# EAGLE design LaunchPadMikroBUS_SIL (EAGLE 6.4)
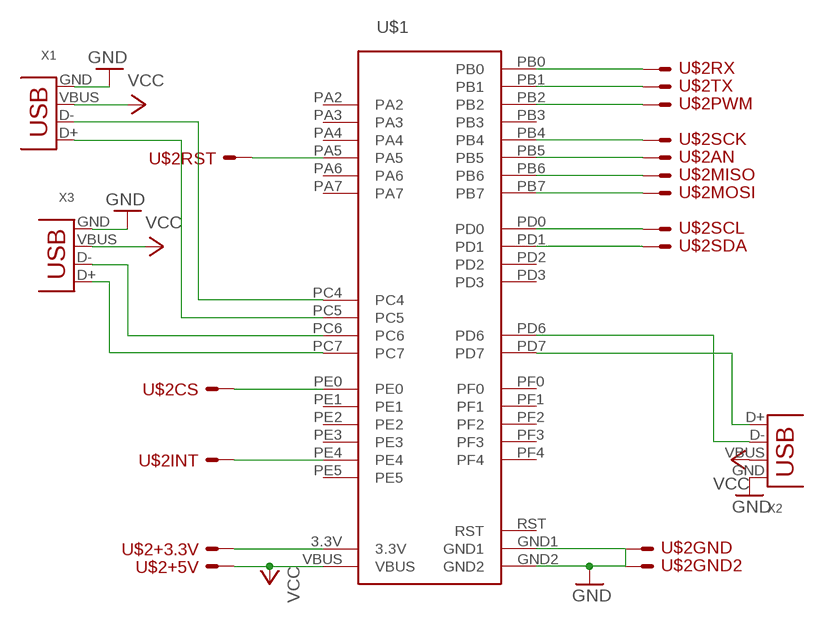
[diagram p0: schematic, sheet 1]

## Parts
U$1  STELLARIS-LAUNCHPADSTELLARIS-LAUNCHPAD-XL  [LAUNCHPAD-XL]
U$2  MIKROBUSSIL  [MIKROBUS_SIL]
X1  USB-A-H  [USB-A-H]
X2  USB-A-H  [USB-A-H]
X3  USB-A-H  [USB-A-H]

## Nets
GND: U$1.GND1 U$1.GND2 U$2.GND U$2.GND2 X1.GND X2.GND X3.GND
N$1: U$1.PB2 U$2.PWM
N$2: U$1.PE4 U$2.INT
N$3: U$1.PB0 U$2.RX
N$4: U$1.PB1 U$2.TX
N$5: U$1.PD0 U$2.SCL
N$6: U$1.PD1 U$2.SDA
N$7: U$1.PC7 X3.D+
N$8: U$1.PC6 X3.D-
N$9: U$1.PC5 X1.D+
N$10: U$1.3.3V U$2.+3.3V
N$11: U$1.PB5 U$2.AN
N$12: U$1.PA5 U$2.RST
N$13: U$1.PE0 U$2.CS
N$14: U$1.PB4 U$2.SCK
N$15: U$1.PB7 U$2.MOSI
N$16: U$1.PB6 U$2.MISO
N$17: U$1.PC4 X1.D-
N$18: U$1.PD7 X2.D+
N$19: U$1.PD6 X2.D-
VCC: U$1.VBUS U$2.+5V X1.VBUS X2.VBUS X3.VBUS
Unconnected: U$1.PA2 U$1.PA3 U$1.PA4 U$1.PA6 U$1.PA7 U$1.PB3 U$1.PD2 U$1.PD3 U$1.PE1 U$1.PE2 U$1.PE3 U$1.PE5 U$1.PF0 U$1.PF1 U$1.PF2 U$1.PF3 U$1.PF4

## Power pins joined to a net without a drawn wire
RST: U$1.RST

## Library data of the parts
U$1 = StellarisLaunchPad_Fred:STELLARIS-LAUNCHPAD
U$2 = lieven:MIKROBUS
X1-X3 = lieven:USB: USB Connectors

## Board
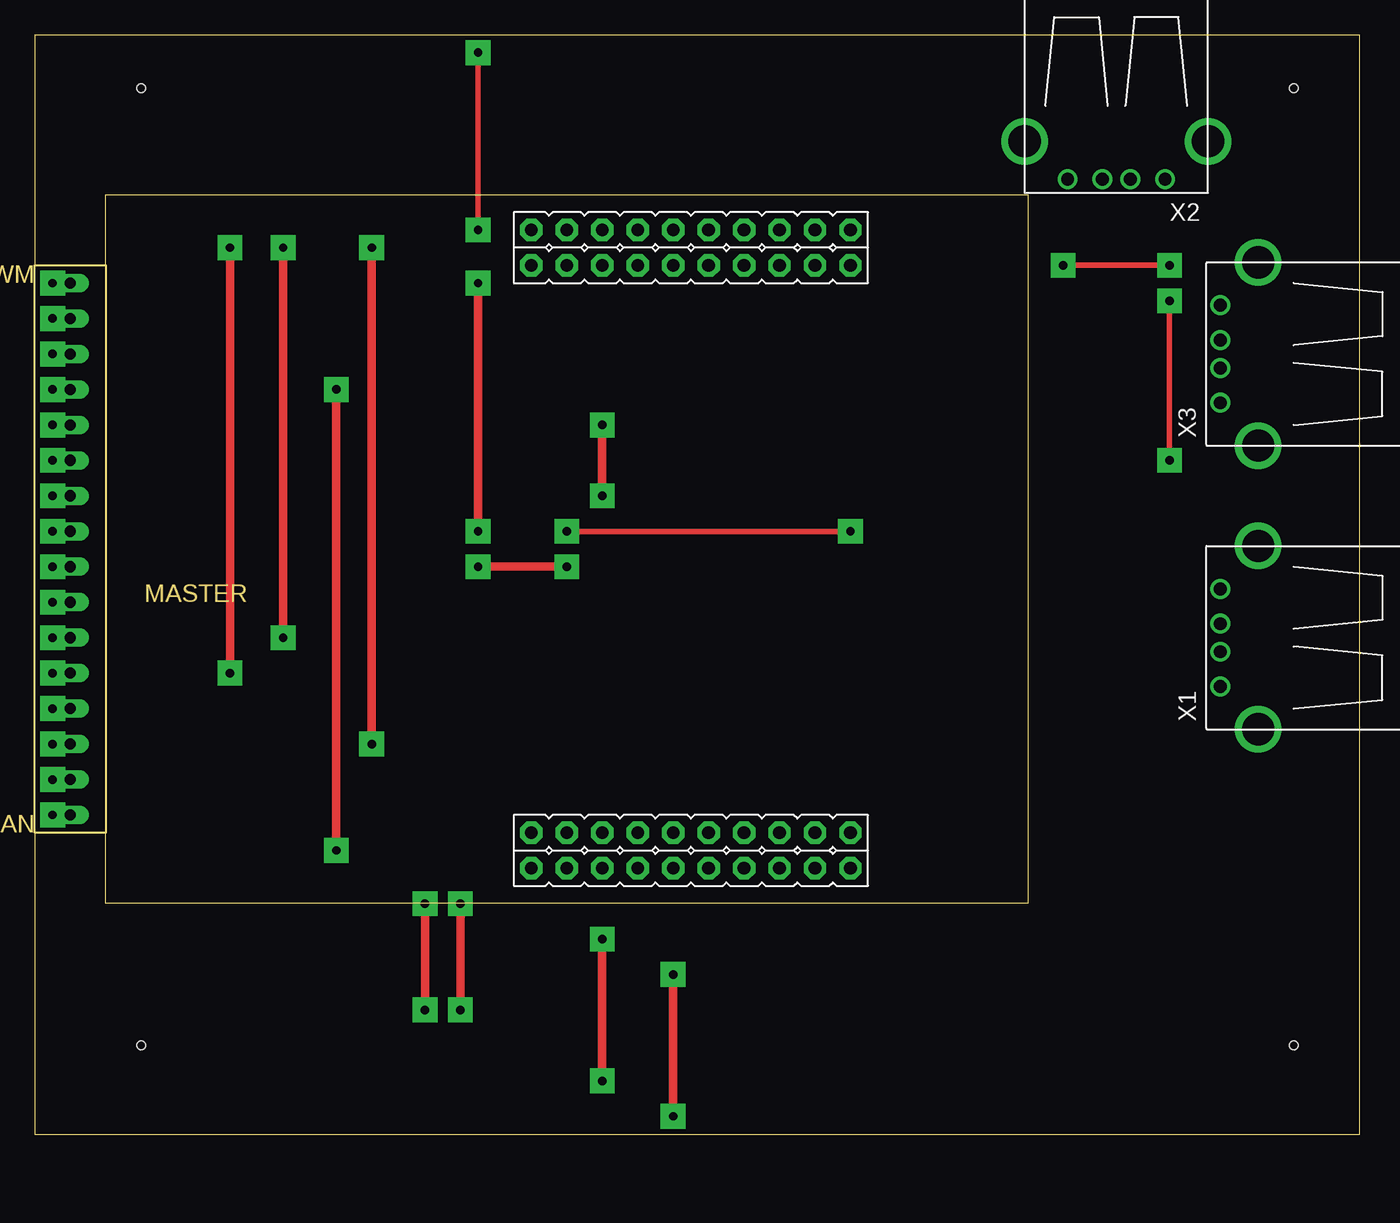
[diagram p1: board, top side]
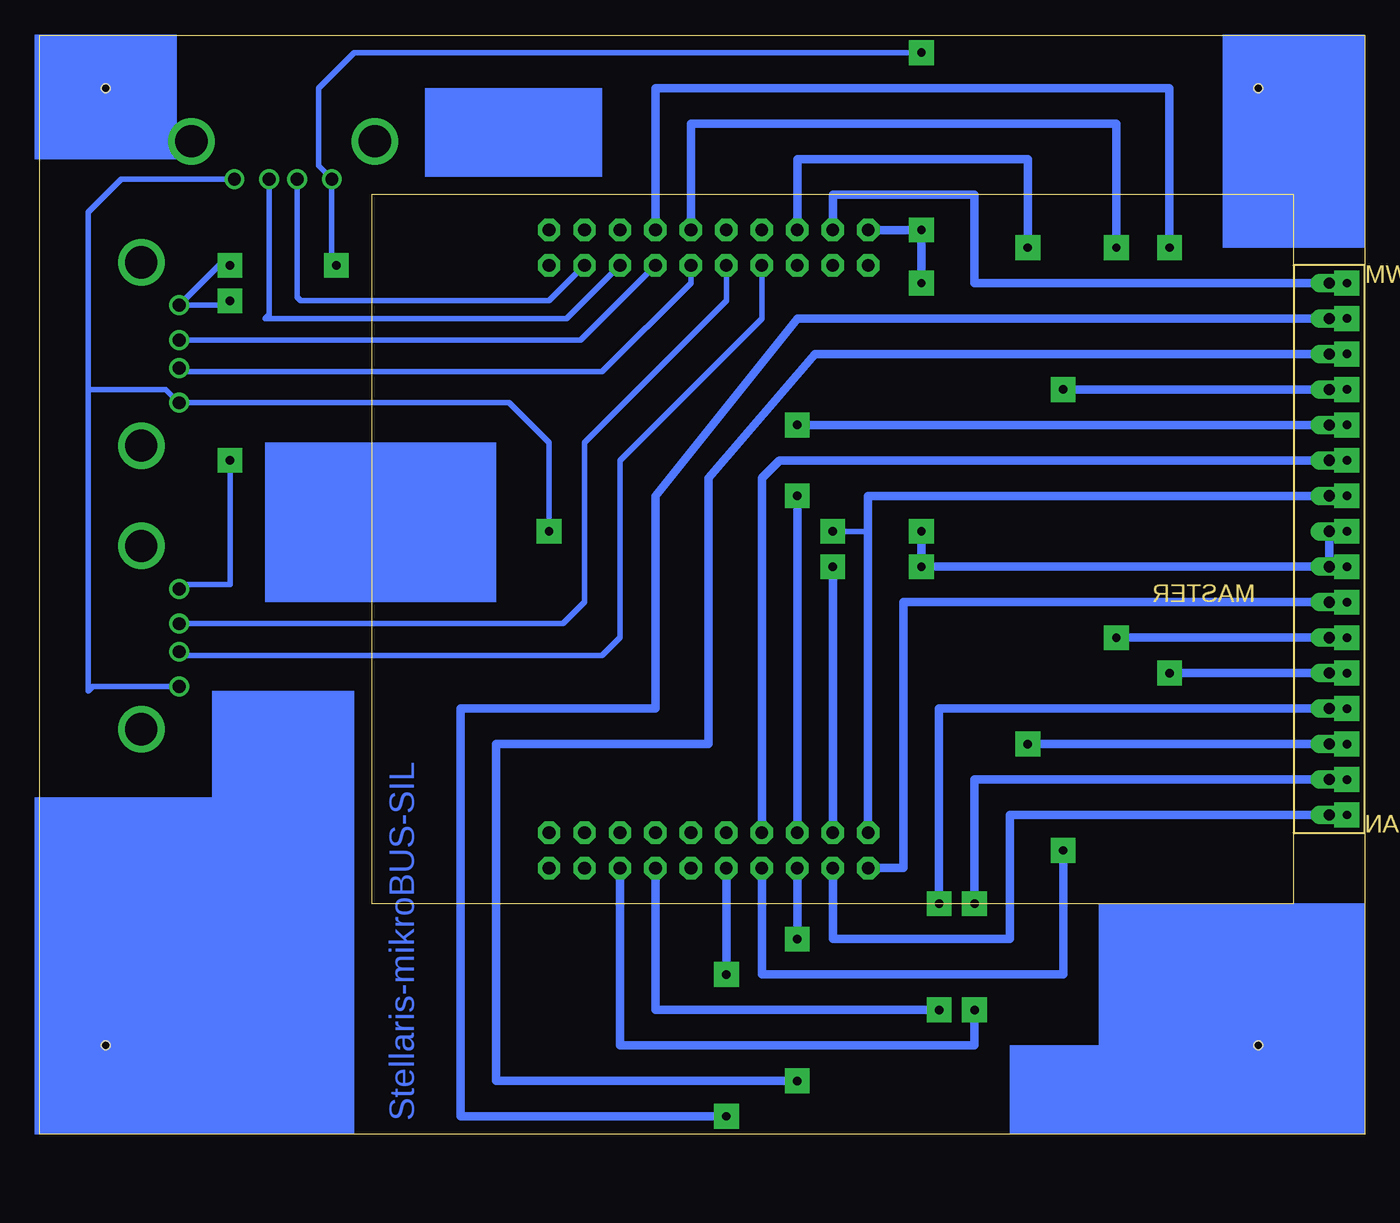
[diagram p2: board, bottom side, seen from below]

Size 94.92 x 78.73 mm. Coordinates in mm from the lower left corner, seen from the top.
Outline: 0,0 94.92,0 94.92,78.73 0,78.73 0,0
Copper layers (1*16): Top 0.035mm / dielectric 1.5mm / Bottom 0.035mm
Design rules "default": minimum track width 10mil, minimum drill 24mil, track to track 8mil, track to pad 8mil, pad to pad 8mil, via to via 8mil, smd to smd 8mil, copper to edge 40mil, drill to drill 8mil, minimum pad ring 10mil, minimum via ring 8mil, stop-mask expansion 4mil, vias tented up to drill 0mil, thermal gap 10mil
Holes 0.6 mm at 7.62,74.93 90.17,74.93 90.17,6.35 7.62,6.35

### Footprints (pad centres in the part's own frame; a part is rotated, then mirrored left to right if it is on the bottom)
LAUNCHPAD-XL = drill 0.914 pad 1.6 octagon: 3.3V 30.48,2.54; GND1 33.02,5.08; GND2 30.48,48.26; PA2 53.34,48.26; PA3 50.8,48.26; PA4 48.26,48.26; PA5 48.26,2.54; PA6 50.8,2.54; PA7 53.34,2.54; PB0 35.56,2.54; PB1 38.1,2.54; PB2 33.02,48.26; PB3 35.56,45.72; PB4 45.72,2.54; PB5 33.02,2.54; PB6 45.72,48.26; PB7 43.18,48.26; PC4 38.1,45.72; PC5 40.64,45.72; PC6 43.18,45.72; PC7 45.72,45.72; PD0 35.56,5.08; PD1 38.1,5.08; PD2 40.64,5.08; PD3 43.18,5.08; PD6 48.26,45.72; PD7 50.8,45.72; PE0 35.56,48.26; PE1 45.72,5.08; PE2 48.26,5.08; PE3 50.8,5.08; PE4 40.64,2.54; PE5 43.18,2.54; PF0 38.1,48.26; PF1 53.34,5.08; PF2 30.48,45.72; PF3 33.02,45.72; PF4 53.34,45.72; RST 40.64,48.26; VBUS 30.48,5.08
MIKROBUS_SIL = drill 0.8 long: +3.3V 0,2.54; +5V 0,-5.08; AN 0,17.78; CS 0,12.7; GND 0,0; GND2 0,-2.54; INT 0,-17.78; MISO 0,7.62; MOSI 0,5.08; PWM 0,-20.32; RST 0,15.24; RX 0,-15.24; SCK 0,10.16; SCL 0,-10.16; SDA 0,-7.62; TX 0,-12.7
USB-A-H = drill 0.914: D+ 2.718,-1.003; D- 2.718,1.003; GND 2.718,-3.493; VBUS 2.718,3.493 | drill 2.311: P$5 0,-6.566; P$6 0,6.566

### Placement (x,y rotation side)
U$1  5.08,16.51 0 top
U$2  2.54,40.64 180 top
X1  87.63,35.56 180 top
X2  77.47,71.12 270 top
X3  87.63,55.88 180 top

### Tracks (layer width: path | path; a pad name or v marks a point on that pad's centre or on a via)
GND  (via drill 0.6 pad 1.78)
  Top 0.406: v31.75,64.77 v31.75,77.47 | v73.66,62.23 v81.28,62.23 | v81.28,59.69 v81.28,48.26
  Top 0.61: v31.75,40.64 v38.1,40.64 | v31.75,60.96 v31.75,43.18
  Bottom 0.406: v31.75,77.47 72.39,77.47 74.93,74.93 74.93,69.35 X2.GND 73.98,62.55 v73.66,62.23 | v81.28,62.23 82.06,62.23 X3.GND 81.6,59.37 v81.28,59.69 | v81.28,48.26 81.28,39.37 84.59,39.37 X1.GND
  Bottom 0.61: v38.1,40.64 U$1.GND1 | U$2.GND2 U$2.GND v31.75,40.64 v31.75,43.18 | U$1.GND2 v31.75,64.77 v31.75,60.96
N$1
  Bottom 0.61: U$2.PWM 27.94,60.96 27.94,67.31 38.1,67.31 U$1.PB2
N$2  (via drill 0.6 pad 1.78)
  Top 0.61: v45.72,1.27 v45.72,11.43
  Bottom 0.61: U$2.INT 40.64,58.42 50.8,45.72 50.8,30.48 64.77,30.48 64.77,1.27 v45.72,1.27 | v45.72,11.43 U$1.PE4
N$3  (via drill 0.6 pad 1.78)
  Top 0.61: v40.64,13.97 v40.64,3.81
  Bottom 0.61: U$1.PB0 v40.64,13.97 | v40.64,3.81 62.23,3.81 62.23,27.94 46.99,27.94 46.99,46.99 39.37,55.88 U$2.RX
N$4  (via drill 0.6 pad 1.78)
  Top 0.61: v21.59,20.32 v21.59,53.34
  Bottom 0.61: U$1.PB1 43.18,11.43 21.59,11.43 v21.59,20.32 | v21.59,53.34 U$2.TX
N$5  (via drill 0.6 pad 1.78)
  Top 0.61: v40.64,45.72 v40.64,50.8
  Bottom 0.61: U$1.PD0 v40.64,45.72 | v40.64,50.8 U$2.SCL
N$6
  Bottom 0.61: U$1.PD1 43.18,46.99 41.91,48.26 U$2.SDA
N$7
  Bottom 0.406: X3.D+ 56.15,56.88 U$1.PC7
N$8
  Bottom 0.406: U$1.PC6 48.26,60.96 54.61,54.61 84.65,54.61 X3.D-
N$9
  Bottom 0.406: X1.D+ 57.42,36.56 55.88,38.1 55.88,49.53 45.72,59.69 U$1.PC5
N$10
  Bottom 0.61: U$1.3.3V 33.02,19.05 33.02,38.1 U$2.+3.3V
N$11
  Bottom 0.61: U$1.PB5 38.1,13.97 25.4,13.97 25.4,22.86 U$2.AN
N$12  (via drill 0.6 pad 1.78)
  Top 0.61: v27.94,16.51 v27.94,8.89
  Bottom 0.61: U$2.RST 27.94,25.4 v27.94,16.51 | v27.94,8.89 27.94,6.35 53.34,6.35 U$1.PA5
N$13  (via drill 0.6 pad 1.78)
  Top 0.61: v24.13,27.94 v24.13,63.5
  Bottom 0.61: U$2.CS v24.13,27.94 | v24.13,63.5 24.13,69.85 40.64,69.85 U$1.PE0
N$14  (via drill 0.6 pad 1.78)
  Top 0.61: v30.48,8.89 v30.48,16.51
  Bottom 0.61: U$1.PB4 50.8,8.89 v30.48,8.89 | v30.48,16.51 30.48,30.48 U$2.SCK
N$15  (via drill 0.6 pad 1.78)
  Top 0.61: v17.78,63.5 v17.78,35.56
  Bottom 0.61: U$1.PB7 48.26,72.39 17.78,72.39 v17.78,63.5 | v17.78,35.56 U$2.MOSI
N$16  (via drill 0.6 pad 1.78)
  Top 0.61: v13.97,33.02 v13.97,63.5
  Bottom 0.61: U$2.MISO v13.97,33.02 | v13.97,63.5 13.97,74.93 50.8,74.93 U$1.PB6
N$17
  Bottom 0.406: U$1.PC4 43.18,58.42 53.34,48.26 53.34,35.56 54.61,34.29 84.65,34.29 X1.D-
N$18
  Bottom 0.406: X2.D+ 76.47,59.96 76.2,59.69 58.42,59.69 U$1.PD7
N$19
  Bottom 0.406: X2.D- 78.47,58.69 78.74,58.42 57.15,58.42 U$1.PD6
N$20  (via drill 0.6 pad 1.78)
  other vias: 1.27,22.86
N$21  (via drill 0.6 pad 1.78)
  other vias: 1.27,25.4
N$22  (via drill 0.6 pad 1.78)
  other vias: 1.27,27.94
N$23  (via drill 0.6 pad 1.78)
  other vias: 1.27,30.48
N$24  (via drill 0.6 pad 1.78)
  other vias: 1.27,33.02
N$25  (via drill 0.6 pad 1.78)
  other vias: 1.27,35.56
N$26  (via drill 0.6 pad 1.78)
  other vias: 1.27,38.1
N$27  (via drill 0.6 pad 1.78)
  other vias: 1.27,40.64
N$28  (via drill 0.6 pad 1.78)
  other vias: 1.27,43.18
N$29  (via drill 0.6 pad 1.78)
  other vias: 1.27,45.72
N$30  (via drill 0.6 pad 1.78)
  other vias: 1.27,48.26
N$31  (via drill 0.6 pad 1.78)
  other vias: 1.27,50.8
N$32  (via drill 0.6 pad 1.78)
  other vias: 1.27,53.34
N$33  (via drill 0.6 pad 1.78)
  other vias: 1.27,55.88
N$34  (via drill 0.6 pad 1.78)
  other vias: 1.27,58.42
N$35  (via drill 0.6 pad 1.78)
  other vias: 1.27,60.96
VCC  (via drill 0.6 pad 1.78)
  Top 0.406: v58.42,43.18 v38.1,43.18
  Bottom 0.406: X1.VBUS 91.12,32.07 91.44,31.75 91.44,53.34 | 91.44,53.34 85.87,53.34 X3.VBUS 61.28,52.39 58.42,49.53 v58.42,43.18 | X2.VBUS 89.08,68.4 91.44,66.04 91.44,53.34 | v38.1,43.18 35.56,43.18
  Bottom 0.61: U$1.VBUS 35.56,43.18 35.56,45.72 U$2.+5V
(copper drawn outside any net)
  shapes: Bottom area x8

### Text on the board
Bottom: Stellaris-mikroBUS-SIL